# EAGLE design jake_client (EAGLE 7.7.0)
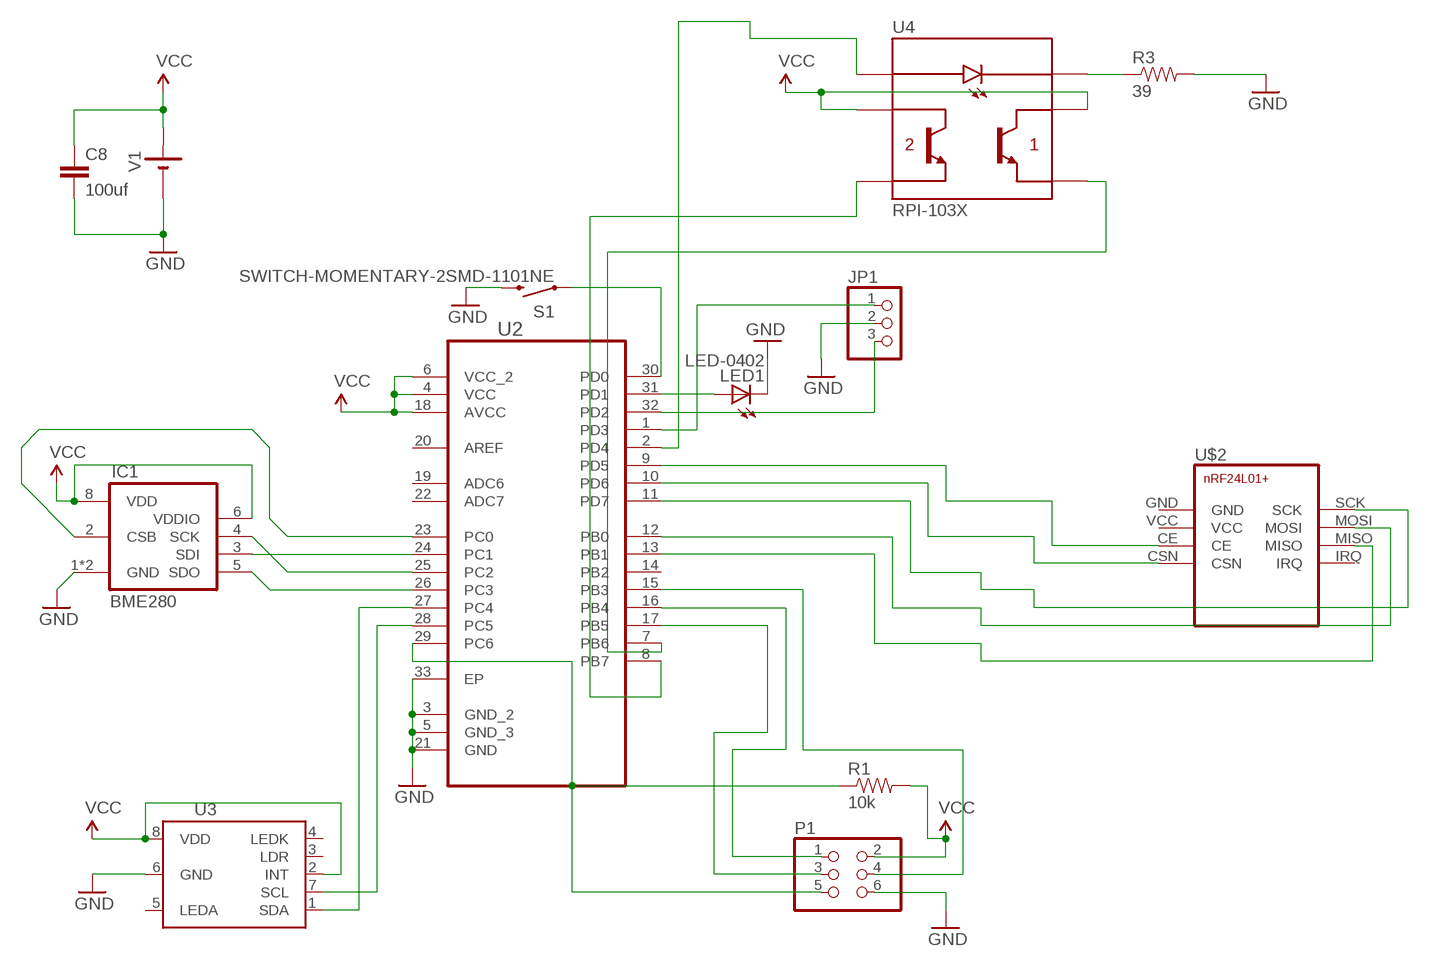
[diagram p0: schematic, sheet 1]

## Parts
C8  100uf  CAP1206  [1206]
IC1  BME280  [BME280]
JP1  PINHD-1X31X03_SMT  [1X03_SMT]
LED1  LED-0402  [0402-LED]
P1  PINHD-2X3SMT  [2X03_SMT]
R1  10k  RESISTOR0402-RES  [0402-RES]
R3  39  RESISTOR0402-RES  [0402-RES]
S1  SWITCH-MOMENTARY-2SMD-1101NE  [TACTILE-SWITCH-1101NE]
U2  ATMEGA328P-MU  [QFN50P500X500X100-33N]
U3  APDS-9960  [APDS-9960]
U4  RPI-103X  [RPI-103X]
U$2  NRF24L01+NRF24L01+MINI  [NRF24L01+MINI]
V1  TAKACHI_BATT-CR123A  [TAKACHI_CR123A]

## Nets
GND: C8.2 IC1.1(GND) IC1.7(GND) JP1.2 LED1.C P1.6 R3.2 S1.2 U2.3(GND_2) U2.5(GND_3) U2.21(GND) U2.33(EP) U3.6(GND) V1.-
N$1: U2.12(PB0) U$2.MOSI
N$2: LED1.A U2.31(PD1)
N$3: IC1.3(SDI) U2.24(PC1)
N$8: IC1.5(SDO) U2.26(PC3)
N$11: P1.3 U2.17(PB5)
N$12: P1.4 U2.15(PB3)
N$13: P1.1 U2.16(PB4)
N$14: P1.5 R1.1 U2.29(PC6)
N$15: U2.27(PC4) U3.1(SDA)
N$16: U2.28(PC5) U3.7(SCL)
N$17: IC1.4(SCK) U2.25(PC2)
N$18: U2.9(PD5) U$2.CE
N$19: U2.10(PD6) U$2.CSN
N$21: U2.11(PD7) U$2.SCK
N$23: IC1.2(CSB) U2.23(PC0)
N$24: JP1.3 U2.32(PD2)
N$25: JP1.1 U2.1(PD3)
N$28: S1.1 U2.30(PD0)
N$29: U2.2(PD4) U4.6(ANODE)
N$30: U2.7(PB6) U4.1(E1)
N$31: U2.8(PB7) U4.4(E2)
N$32: R3.1 U4.3(CATHODE)
N$37: U2.13(PB1) U$2.MISO
VCC: C8.1 IC1.6(VDDIO) IC1.8(VDD) P1.2 R1.2 U2.4(VCC) U2.6(VCC_2) U2.18(AVCC) U3.2(INT) U3.8(VDD) U4.2(C1) U4.5(C2) V1.+
Unconnected: U2.14(PB2) U2.19(ADC6) U2.20(AREF) U2.22(ADC7) U3.3(LDR) U3.4(LEDK) U3.5(LEDA) U$2.IRQ

## Power pins joined to a net without a drawn wire
GND: U$2.GND
VCC: U$2.VCC

## Library data of the parts
C8 = SparkFun-Capacitors:CAP: Capacitor Standard 0603 ceramic capacitor, and 0.1" leaded capacitor.
IC1 = bosch-bme280:BME280: DIGITAL HUMIDITY, PRESSURE AND TEMPERATURE SENSOR * Digital interface I²C (up to 3.4 MHz) and SPI (3 and 4 wire, up to 10 MHz)* Supply voltage VDD main supply voltage range: 1.71 V to 3.6 V*VDDIO interface voltage range: 1.2 V to 3.6 V Operating range -40…+85 °C, 0…100 % rel. humidity, 300…1100 hPa The library has been designed by Richard Magdycz <https://www.facebook.com/groups/eaglecadsoftUK>
JP1 = pinhead+:PINHD-1X3: PIN HEADER
LED1 = pel_dipol_comp:LED
P1 = pinhead+:PINHD-2X3: PIN HEADER
R1 R3 = SparkFun:RESISTOR: Resistor Basic schematic elements and footprints for 0603, 1206, and PTH resistors.
S1 = SparkFun-Electromechanical:SWITCH-MOMENTARY-2: Various NO switches- pushbuttons, reed, etc; PROD_ID: SWCH-00815
U2 = Ava:ATMEGA328P-MU: Programmable Flash; MPN: ATMEGA328P-MU; OC_FARNELL: 1748522; OC_NEWARK: 26R2526; PACKAGE: QFN-32; SUPPLIER: Atmel
U3 = SparkFun-Sensors:APDS-9960: Avago APDS-9960 digital proximity, ambient light, RGB, and gesture sensor.; PROD_ID: SEN-12005
U4 = SparkFun-Sensors:RPI-103X; PROD_ID: 10414
U$2 = nrf24L01:NRF24L01+: nRF24L01+ Transceiver Module
V1 = battery_xtra:TAKACHI_BATT: Takachi Batt. case Producted by TAKACHI.Co

## Board
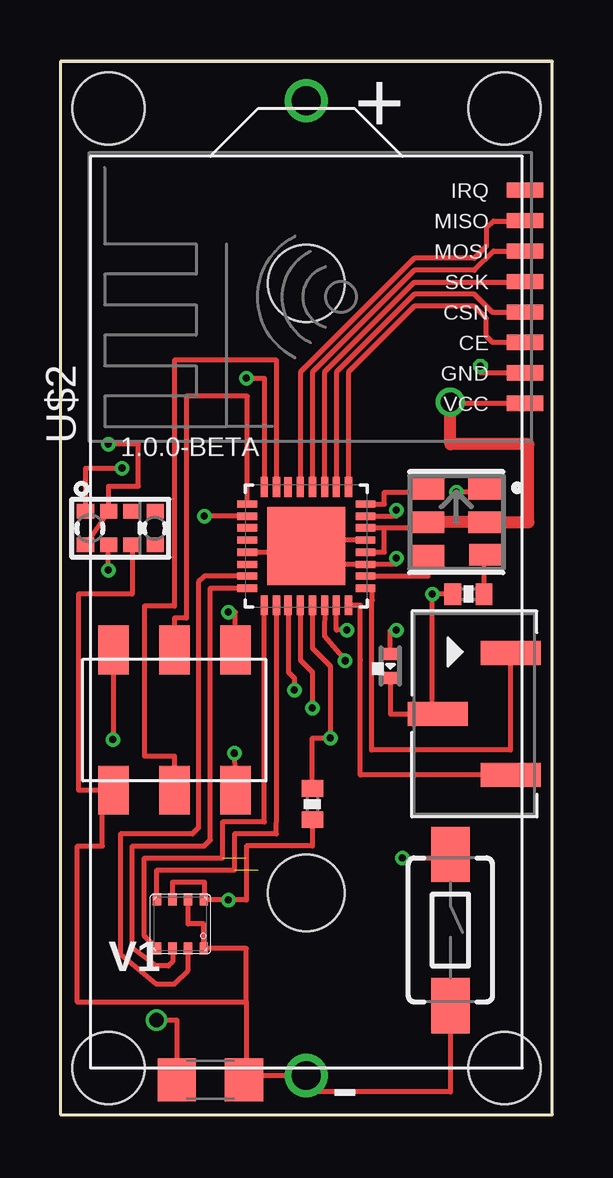
[diagram p1: board, top side]
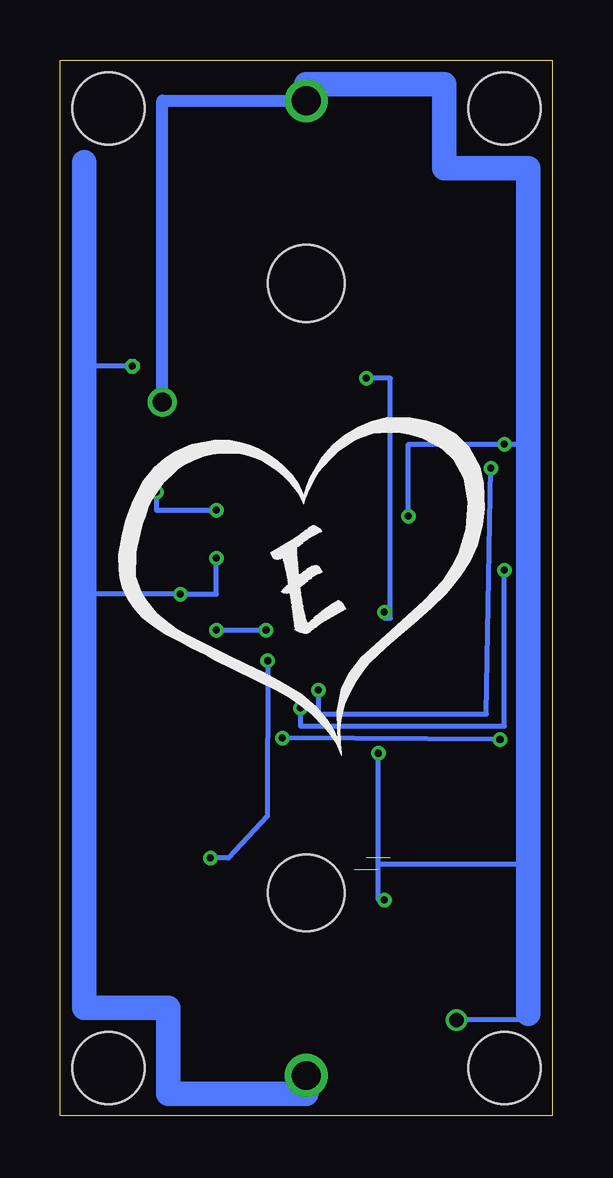
[diagram p2: board, bottom side, seen from below]

Size 20.5 x 44 mm. Coordinates in mm from the lower left corner, seen from the top.
Outline: 0,0 20.5,0 20.5,44 0,44 0,0
Copper layers (1*16): Top 0.035mm / dielectric 1.5mm / Bottom 0.035mm
Design rules "dirt_cheap_dirty_boards.v1": minimum track width 5mil, minimum drill 0.3mm, track to track 6mil, track to pad 6mil, pad to pad 6mil, via to via 6mil, smd to smd 0mil, copper to edge 10mil, drill to drill 10mil, minimum pad ring 10mil, minimum via ring 6mil, stop-mask expansion 2mil, vias tented up to drill 25mil, thermal gap 10mil
Holes 3 mm at 18.5,2 2,2 2,42 18.5,42

### Footprints (pad centres in the part's own frame; a part is rotated, then mirrored left to right if it is on the bottom)
1206 = smd 1.6 x 1.8: 1 -1.4,0; 2 1.4,0
BME280 = smd 0.35 x 0.5: 1 0.975,-1.025; 2 0.325,-1.025; 3 -0.325,-1.025; 4 -0.975,-1.025; 5 -0.975,1.025; 6 -0.325,1.025; 7 0.325,1.025; 8 0.975,1.025
1X03_SMT = smd 1 x 2.5: 1 -2.54,1.52; 2 0,-1.52; 3 2.54,1.52
0402-LED = smd 0.5 x 0.6: A 0.5,0; C -0.5,0
2X03_SMT = smd 1.27 x 2.032: 1 -2.54,-2.921; 2 -2.54,2.921; 3 0,-2.921; 4 0,2.921; 5 2.54,-2.921; 6 2.54,2.921
0402-RES = smd 0.7 x 0.9: 1 -0.65,0; 2 0.65,0
TACTILE-SWITCH-1101NE = smd 2.3 x 1.6: 1 -3.15,0; 2 3.15,0
QFN50P500X500X100-33N = smd 0.813 x 0.305: 1 -2.464,1.753; 2 -2.464,1.245; 3 -2.464,0.762; 4 -2.464,0.254; 5 -2.464,-0.254; 6 -2.464,-0.762; 7 -2.464,-1.245; 8 -2.464,-1.753; 17 2.464,-1.753; 18 2.464,-1.245; 19 2.464,-0.762; 20 2.464,-0.254; 21 2.464,0.254; 22 2.464,0.762; 23 2.464,1.245; 24 2.464,1.753 | smd 0.305 x 0.813: 9 -1.753,-2.464; 10 -1.245,-2.464; 11 -0.762,-2.464; 12 -0.254,-2.464; 13 0.254,-2.464; 14 0.762,-2.464; 15 1.245,-2.464; 16 1.753,-2.464; 25 1.753,2.464; 26 1.245,2.464; 27 0.762,2.464; 28 0.254,2.464; 29 -0.254,2.464; 30 -0.762,2.464; 31 -1.245,2.464; 32 -1.753,2.464 | smd 3.251 x 3.251: 33 0,0
APDS-9960 = smd 0.6 x 0.72: 1 0.7,1.455; 2 0.7,0.485; 3 0.7,-0.485; 4 0.7,-1.455; 5 -0.7,-1.455; 6 -0.7,-0.485; 7 -0.7,0.485; 8 -0.7,1.455
RPI-103X = smd 1.35 x 0.9: 1 1.175,1.4; 2 1.175,0; 3 1.22,-1.355; 4 -1.175,1.4; 5 -1.175,0; 6 -1.175,-1.4
NRF24L01+MINI = smd 0.635 x 1.524: CE -1.575,-7.861; CSN -0.305,-7.861; GND -2.845,-7.861; IRQ 4.775,-7.861; MISO 3.505,-7.861; MOSI 2.235,-7.861; SCK 0.965,-7.861; VCC -4.115,-7.861
TAKACHI_CR123A = drill 1.2: + 0,20.32; - 0,-20.32 | hole 3.2: 0,12.7; 0,-12.7

### Placement (x,y rotation side)
C8  6.25,1.5 0 top
IC1  5,8 0 top
JP1  17.25,16.75 270 top
LED1  13.75,18.75 90 top
P1  4.75,16.5 180 top
R1  10.5,13 270 top
R3  17,21.75 180 top
S1  16.25,7.75 270 top
U2  10.25,23.75 180 top
U3  2.5,24.5 90 top
U4  16.5,24.75 0 top
U$2  11.5,33.81 90 top
V1  10.25,22 0 top

### Tracks (layer width: path | path; a pad name or v marks a point on that pad's centre or on a via)
GND  (via drill 0.3)
  Top 0.2: S1.2 16.25,1 10.25,1 V1.- 7.65,1.68 C8.2 7.75,1.5 7.75,4.75 | U2.21 10.25,23.5 U2.33 | U2.5 10.25,24 U2.33 | U2.33 10.25,22.99 U2.3 14,22.99 v14,23.25 | R3.2 v15.5,21.75 15.5,16.75 JP1.2 13.75,16.75 LED1.C | 7.75,4.75 0.71,4.75 0.71,11.25 1.75,11.25 1.75,13.58 | U3.6 2.98,21.75 0.75,21.75 0.75,13.58 1.75,13.58 | IC1.7 5.32,8 5.98,8 IC1.1 7.75,6.97 7.75,4.75 | 2.25,13.58 P1.6 1.75,13.58 | U$2.GND 17.5,30.97 v17.5,31.25
  Bottom 0.2: 19.5,21.75 v15.5,21.75 14,21.75 v14,23.25 | v17.5,31.25 19.5,31.25
  Bottom 1.016: 19.5,39.75 19.5,31.25 19.5,21.75 19.5,4.5 16,4.5 16,0.93 10.25,0.93 V1.-
N$1
  Top 0.2: U2.12 10.5,26.5 10.5,31 14.75,35.25 17.25,35.25 18.05,36.05 U$2.MOSI | U$2.MOSI
N$2  (via drill 0.3)
  Top 0.2: LED1.A 13.75,20.25 v14,20.25 | v11.94,20.25 11.49,20.25 U2.31
  Bottom 0.2: v14,20.25 v11.94,20.25
N$3
  Top 0.2: IC1.3 4.68,6.43 4.5,6.25 4,6.25 3,7 3,11.25 6,11.25 6.25,11.5 6.25,22 U2.24
N$8  (2 unrouted)
  Top 0.2: IC1.5 4.02,10.25 7.25,10.25 7.25,11.75 9,11.75 9.01,12.75 U2.26
N$11
  Top 0.2: U2.17 7.79,30 5.25,30 5.25,20.75 4.75,20.75 P1.3
N$12
  Top 0.2: U2.15 9.01,31.5 4.75,31.5 4.75,21.25 3.5,21.25 3.5,15 4.75,15 P1.4
N$13  (via drill 0.3)
  Top 0.2: P1.1 7.29,21 v7,21 | v7.75,30.75 8.5,30.75 U2.16
  Bottom 0.2: v7.75,30.75 6.75,30.75 6.75,20.75 7,20.75 v7,21
N$14  (via drill 0.3)  (1 unrouted)
  Top 0.2: U2.29 10.5,19.5 11.25,18.75 v11.25,15.75 10.5,15.75 R1.1 | P1.5 2.21,16.19 v2.18,15.69
  Bottom 0.2: v2.18,15.69 v11.25,15.75
N$15  (via drill 0.3)
  Top 0.2: U3.1 1.05,27 v2.57,27 | U2.27 9.5,18.5 9.75,18.25 v9.75,17.75
  Bottom 0.2: v2.57,27 2.75,16.75 9.75,16.75 v9.75,17.75
N$16  (via drill 0.3)
  Top 0.2: v2,22.75 2,23.8 U3.7 | U2.28 10,19 10.5,18.5 v10.5,17
  Bottom 0.2: v2,22.75 2,16.25 10.5,16.25 v10.5,17
N$17  (1 unrouted)
  Top 0.2: IC1.4 3.5,7.5 3.5,10.75 6.75,10.75 6.75,12.25 8.5,12.25 U2.25
N$18
  Top 0.2: U2.9 12,26.5 12,31 14.75,33.75 17.25,33.75 17.75,33.25 17.75,32.5 18,32.25 U$2.CE
N$19
  Top 0.2: U2.10 11.5,26.51 11.5,31 14.75,34.25 17.25,34.25 18,33.5 U$2.CSN
N$21
  Top 0.2: U2.11 11,26.49 11,31 14.75,34.75 19.36,34.75 U$2.SCK
N$23
  Top 0.2: U2.23 6,22.5 5.75,22.25 5.75,12 5.5,11.75 2.5,11.75 2.5,6.75 4,5.5 4.75,5.5 5.32,6.07 IC1.2
N$24
  Top 0.2: JP1.3 12.5,14.21 12.5,19 12.5,21.29 U2.32
N$25
  Top 0.2: JP1.1 18.75,19.29 18.75,15.25 12.96,15.25 12.96,21.5 13,21.5 13,22 U2.1
N$28  (via drill 0.3)
  Top 0.2: U2.30 11,20 v11.87,18.98 | v14.25,10.75 16.1,10.75 S1.1
  Bottom 0.2: v11.87,18.98 11.88,12.5 13.5,10.75 v14.25,10.75
N$29
  Top 0.2: U2.2 15.33,22.5 U4.6
N$30  (via drill 0.3)
  Top 0.2: U4.1 17.52,26 v16.5,26 | v14,25.25 14,24.99 U2.7
  Bottom 0.2: v16.5,26 16.5,25.25 v14,25.25
N$31
  Top 0.2: U2.8 13.25,25.5 13.5,25.5 13.5,26 15.17,26 U4.4
N$32
  Top 0.2: U4.3 17.65,23.39 R3.1
N$37
  Top 0.2: U2.13 10,26.51 10,31 14.75,35.75 17.25,35.75 17.75,36.25 17.75,37 18.05,37.3 19.36,37.3 U$2.MISO
VCC  (via drill 0.3, 0.6, 0.8)
  Top 0.2: v4,4 4.85,4 C8.1 | 7.23,15.11 v7.25,15.12 P1.2 | U4.5 15.33,24.51 13.5,24.51 | 13.5,24.51 U2.6 | U2.4 13.5,23.5 13.5,24.51 | U3.8 U3.2 2.02,26.25 3.25,26.25 3.25,28 v2,28 | U2.18 v6,25 | IC1.6 4.68,9.75 6,9.75 6,9.02 IC1.8 7,9.02 v7,9 7.75,9 7.75,11.25 10.5,11.25 R1.2 | U$2.VCC 16.25,29.7 v16.25,29.75
  Top 0.5: v16.25,29.75 16.25,28 19.5,28 19.5,24.75 U4.2 U4.5
  Bottom 0.2: 1,4.25 1,4 v4,4 | 7.25,10.5 1,10.5 | 1,28 v2,28 6,28 v6,25 | 7.25,10.5 v7.25,15.12 | v7,9 7.25,9 7.25,10.5
  Bottom 0.5: v16.25,29.75 16.25,42.32 V1.+
  Bottom 1.016: V1.+ 10.25,43 4.5,43 4.5,39.5 1,39.5 1,28 1,10.5 1,4.25

### Text on the board
tPlace: 1.0.0-BETA